# Altium schematic sheet POWER.schdoc
size 226 x 125 mm
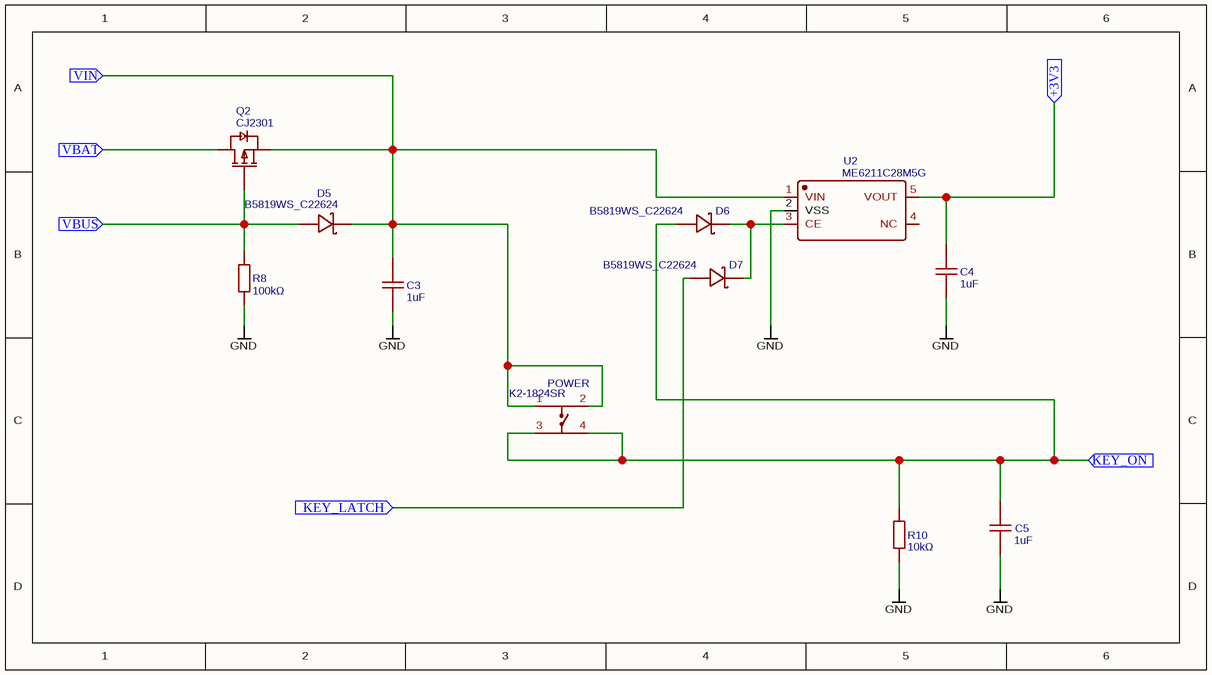
[diagram p0: POWER.schdoc]

## Parts
C3  1uF  [C0603]
C4  1uF  [C0603]
C5  1uF  [C0603]
D5  B5819WS_C22624  [SOD-323_L1.8-W1.3-LS2.5-RD]
D6  B5819WS_C22624  [SOD-323_L1.8-W1.3-LS2.5-RD]
D7  B5819WS_C22624  [SOD-323_L1.8-W1.3-LS2.5-RD]
POWER  K2-1824SR  [SW-SMD_4P-L4.5-W4.5-P3.50-LS5.0]
Q2  CJ2301  [SOT-23-3_L2.9-W1.3-P1.90-LS2.4-BR]
R8  100kΩ  [R0603]
R10  10kΩ  [R0603]
U2  ME6211C28M5G  [SOT-23-5_L3.0-W1.7-P0.95-LS2.8-BR]

## Ports
+3V3 (in), KEY_LATCH (in), KEY_ON (in), VBAT (in), VBUS (in), VIN (in)

## Nets
GND: C3.1 C4.1 C5.1 R8.1 R10.1 U2.2(VSS)
+3V3: C4.2 U2.5(VOUT) ; port +3V3
KEY_LATCH: D7.2(A) ; port KEY_LATCH
KEY_ON: C5.2 D6.2(A) POWER.3 POWER.4 R10.2 ; port KEY_ON
VBAT: Q2.3(D) ; port VBAT
VBUS: D5.2(A) Q2.1(G) R8.2 ; port VBUS
VIN: C3.2 D5.1(K) POWER.1 POWER.2 Q2.2(S) U2.1(VIN) ; port VIN
NetD6_1: D6.1(K) D7.1(K) U2.3(CE)

Not connected (* = marked no-connect by the designer): U2 4(NC)

## Library data of the parts
C3-C5 = 1uF: BOM_Manufacturer: FH; BOM_Manufacturer Part: 0603B105K160NT; nameAlias: Capacitance; BOM_Supplier: LCSC; BOM_Supplier Part: C93816; BOM_JLCPCB Part Class: Extended Part; spicePre: C; spiceSymbolName: 0603B105K160NT
D5-D7 = B5819WS_C22624: BOM_Manufacturer: CJ; BOM_Supplier: LCSC; BOM_Manufacturer Part: B5819WS; BOM_Supplier Part: C22624; BOM_JLCPCB Part Class: Extended Part; spicePre: D; spiceSymbolName: B5819WS_C22624
POWER = K2-1824SR: BOM_Manufacturer: HRO; BOM_Manufacturer Part: K2-1824SR-B4SW-06; Contributor: LCSC; BOM_Supplier: LCSC; BOM_Supplier Part: C128938; BOM_JLCPCB Part Class: Extended Part; spicePre: S; spiceSymbolName: K2-1824SR-B4SW-06
Q2 = CJ2301: BOM_Manufacturer: CJ（江苏长电/长晶）; Contributor: LCSC; BOM_Supplier: LCSC; BOM_Supplier Part: C2910170; BOM_Manufacturer Part: CJ2301; spicePre: Q; spiceSymbolName: CJ2301
R8 = 100kΩ: BOM_Manufacturer: FH; BOM_Manufacturer Part: RS-03K1003FT; Resistance (Ohms): 100K; nameAlias: Resistance; Contributor: LCSC; BOM_Supplier: LCSC; BOM_Supplier Part: C115320; BOM_JLCPCB Part Class: Extended Part; spicePre: R; spiceSymbolName: RS-03K1003FT_C115320
R10 = 10kΩ: BOM_Manufacturer: Guangdong Fenghua Advanced Tech; BOM_Manufacturer Part: RS-03K1002FT; Resistance (Ohms): 10K; nameAlias: Resistance; Contributor: LCSC; BOM_Supplier: LCSC; BOM_Supplier Part: C115324; BOM_JLCPCB Part Class: Extended Part; spicePre: R; spiceSymbolName: RS-03K1002FT
U2 = ME6211C28M5G: BOM_Manufacturer: MICRONE; BOM_Manufacturer Part: ME6211C33M5G-N; BOM_Supplier: LCSC; BOM_Supplier Part: C82942; BOM_JLCPCB Part Class: Extended Part; spicePre: U; spiceSymbolName: ME6211C28M5G